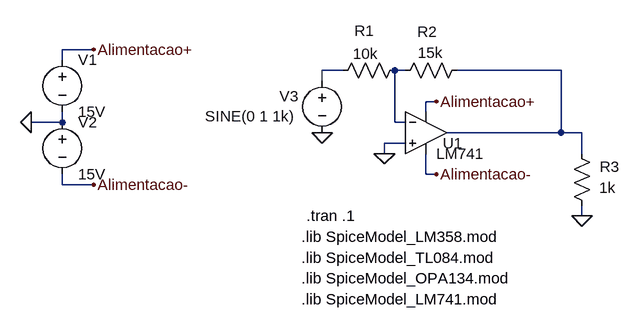
[diagram p0: schematic Tutorial_LTSpice_Ep7-OpAmp.asc]
Tutorial_LTSpice_Ep7-OpAmp.asc, the LTspice schematic file:
Version 4
SHEET 1 880 680
WIRE -48 32 -96 32
WIRE -96 48 -96 32
WIRE 336 64 304 64
WIRE 432 64 416 64
WIRE 672 64 512 64
WIRE 304 80 304 64
WIRE 480 112 464 112
WIRE 464 128 464 112
WIRE -96 144 -96 128
WIRE -96 144 -144 144
WIRE 416 144 416 64
WIRE 432 144 416 144
WIRE 672 160 672 64
WIRE 672 160 496 160
WIRE 704 160 672 160
WIRE 432 176 400 176
WIRE 400 192 400 176
WIRE 704 192 704 160
WIRE 464 224 464 192
WIRE 480 224 464 224
WIRE -96 240 -96 224
WIRE -48 240 -96 240
WIRE 704 288 704 272
FLAG -144 144 0
FLAG -48 32 Alimentacao+
FLAG -48 240 Alimentacao-
FLAG 480 112 Alimentacao+
FLAG 480 224 Alimentacao-
FLAG 400 192 0
FLAG 704 288 0
FLAG 304 160 0
SYMBOL Opamps\\opamp2 464 96 R0
WINDOW 0 26 80 Left 2
SYMATTR InstName U1
SYMATTR Value LM741
SYMBOL voltage -96 32 R0
WINDOW 123 0 0 Left 0
WINDOW 39 0 0 Left 0
SYMATTR InstName V1
SYMATTR Value 15V
SYMBOL voltage -96 128 R0
WINDOW 123 0 0 Left 0
WINDOW 39 0 0 Left 0
SYMATTR InstName V2
SYMATTR Value 15V
SYMBOL res 432 48 R90
WINDOW 0 -29 63 VBottom 2
WINDOW 3 -25 61 VTop 2
SYMATTR InstName R1
SYMATTR Value 10k
SYMBOL res 528 48 R90
WINDOW 0 -28 62 VBottom 2
WINDOW 3 -27 57 VTop 2
SYMATTR InstName R2
SYMATTR Value 15k
SYMBOL res 720 288 R180
WINDOW 0 -42 76 Left 2
WINDOW 3 -36 43 Left 2
SYMATTR InstName R3
SYMATTR Value 1k
SYMBOL voltage 304 64 R0
WINDOW 0 -66 40 Left 2
WINDOW 3 -180 71 Left 2
WINDOW 123 0 0 Left 0
WINDOW 39 0 0 Left 0
SYMATTR InstName V3
SYMATTR Value SINE(0 1 1k)
TEXT 280 288 Left 2 !.tran .1
TEXT 272 320 Left 2 !.lib SpiceModel_LM358.mod
TEXT 272 352 Left 2 !.lib SpiceModel_TL084.mod
TEXT 272 384 Left 2 !.lib SpiceModel_OPA134.mod
TEXT 272 416 Left 2 !.lib SpiceModel_LM741.mod

The netlist it stands for:
* Tutorial_LTSpice_Ep7-OpAmp.asc
XU1 0 N002 Alimentacao+ Alimentacao- N003 LM741  ; pins In+ In- V+ V- OUT
V1 Alimentacao+ 0 15V
V2 0 Alimentacao- 15V
R1 N002 N001 10k
R2 N003 N002 15k
R3 0 N003 1k
V3 N001 0 SINE(0 1 1k)
.tran .1
.lib SpiceModel_LM358.mod
.lib SpiceModel_TL084.mod
.lib SpiceModel_OPA134.mod
.lib SpiceModel_LM741.mod
.backanno
.end